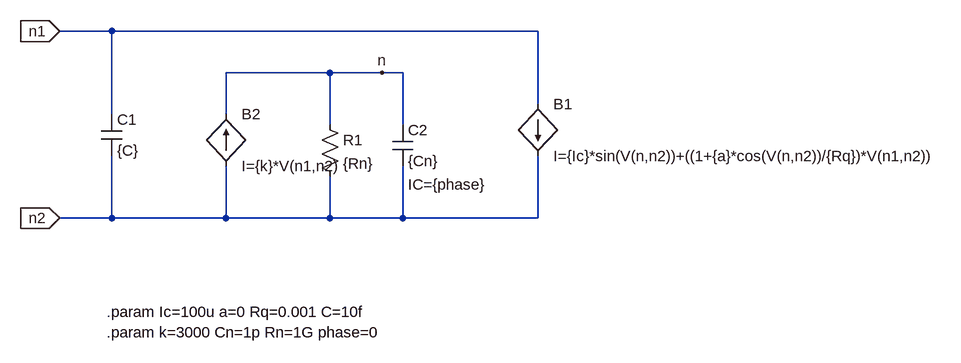
[diagram p0: schematic josephson_junction.asc]
josephson_junction.asc, the LTspice schematic file:
Version 4
SHEET 1 1360 680
WIRE 16 160 16 32
WIRE 16 32 672 32
WIRE 672 32 672 144
WIRE 16 224 16 320
WIRE 16 320 192 320
WIRE 672 320 672 224
WIRE 16 32 -64 32
WIRE 16 320 -64 320
WIRE 192 240 192 320
WIRE 192 320 352 320
WIRE 192 160 192 96
WIRE 192 96 352 96
WIRE 352 176 352 96
WIRE 352 256 352 320
WIRE 352 320 464 320
WIRE 352 96 432 96
WIRE 464 96 464 176
WIRE 464 240 464 320
WIRE 464 320 672 320
WIRE 432 96 464 96
FLAG -64 32 n1
IOPIN -64 32 In
FLAG -64 320 n2
IOPIN -64 320 In
FLAG 432 96 n
SYMBOL cap 0 160 R0
SYMATTR InstName C1
SYMATTR Value {C}
SYMBOL bi 672 144 R0
SYMATTR InstName B1
SYMATTR Value I={Ic}*sin(V(n,n2))+((1+{a}*cos(V(n,n2))/{Rq})*V(n1,n2))
SYMBOL bi2 192 160 R0
SYMATTR InstName B2
SYMATTR Value I={k}*V(n1,n2)
SYMBOL res 336 160 R0
SYMATTR InstName R1
SYMATTR Value {Rn}
SYMBOL cap 448 176 R0
WINDOW 123 24 92 Left 0
SYMATTR Value2 IC={phase}
SYMATTR InstName C2
SYMATTR Value {Cn}
TEXT 8 464 Left 0 !.param Ic=100u a=0 Rq=0.001 C=10f
TEXT 8 496 Left 0 !.param k=3000 Cn=1p Rn=1G phase=0

The netlist it stands for:
* josephson_junction.asc
C1 n1 n2 {C}
B1 n1 n2 I={Ic}*sin(V(n,n2))+((1+{a}*cos(V(n,n2))/{Rq})*V(n1,n2))
B2 n2 n I={k}*V(n1,n2)
R1 n n2 {Rn}
C2 n n2 {Cn} IC={phase}
.param Ic=100u a=0 Rq=0.001 C=10f
.param k=3000 Cn=1p Rn=1G phase=0
.backanno
.end